# Altium schematic sheet Sheet1.SchDoc
size A4
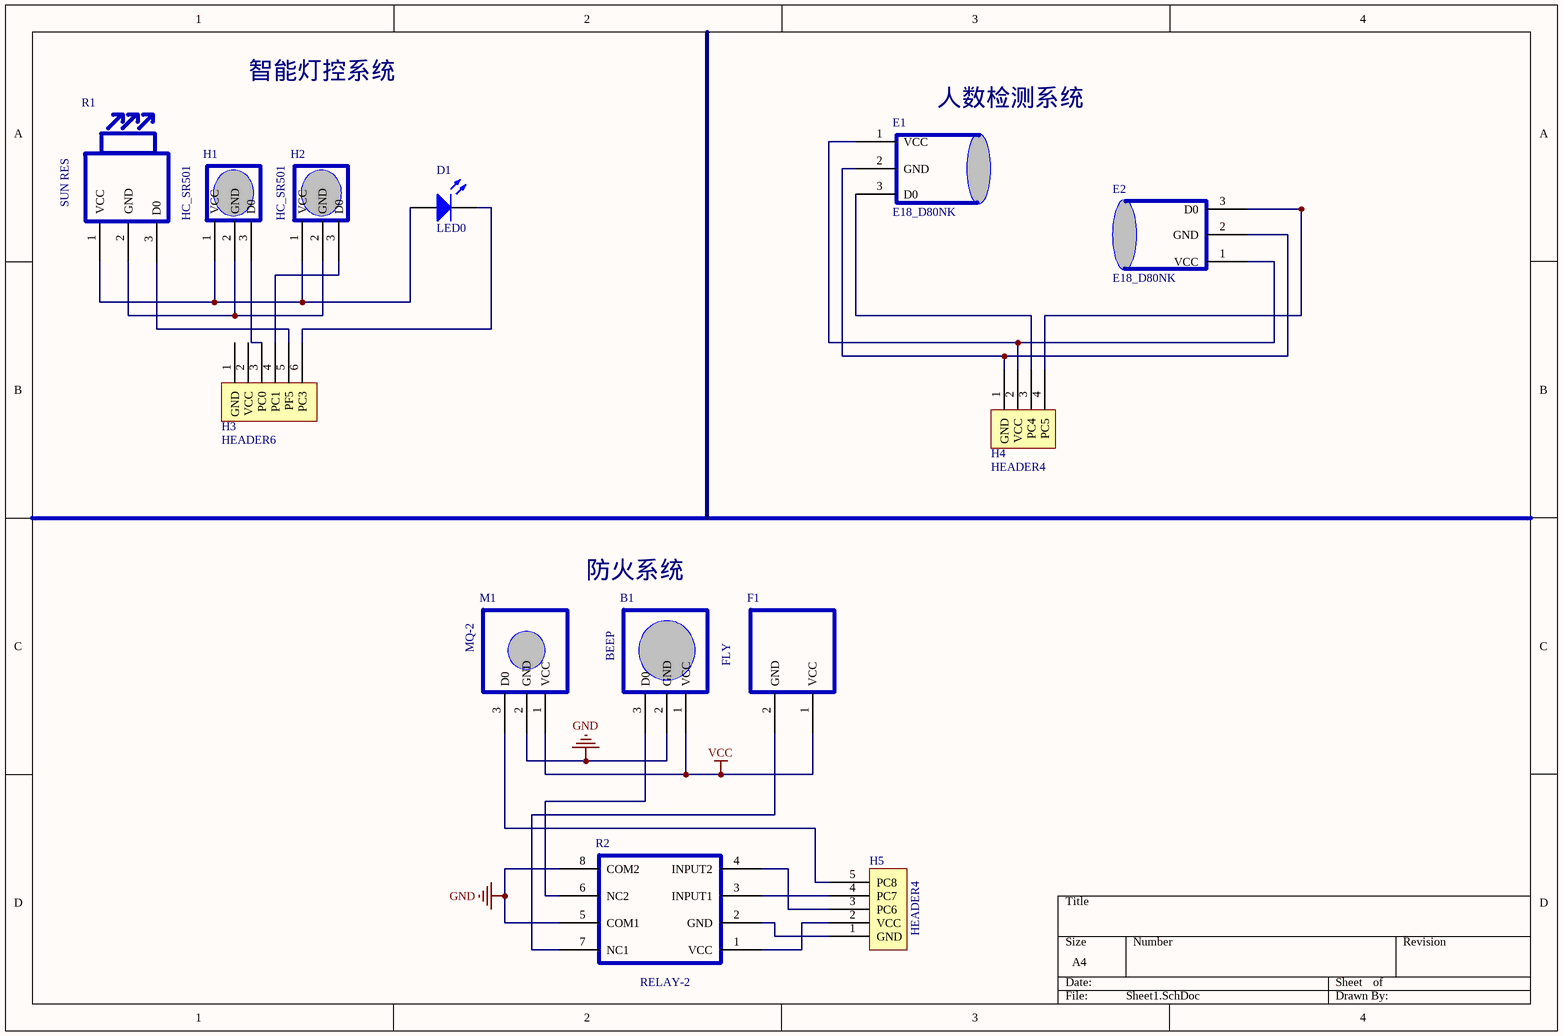
[diagram p0: Sheet1.SchDoc]

## Parts
B1  BEEP
D1  LED0  [LED-0]
E1  E18_D80NK
E2  E18_D80NK
F1  FLY
H1  HC_SR501
H2  HC_SR501
H3  HEADER6
H4  HEADER4
H5  HEADER4
M1  MQ-2
R1  SUN RES
R2  RELAY-2

## Nets
GND: B1.2(GND) M1.2(GND) R2.5(COM1) R2.8(COM2)
VCC: B1.1(VCC) F1.1(VCC) M1.1(VCC)
NetB1_3: B1.3(D0) R2.6(NC2)
NetD1_1: D1.1(A) H1.1(VCC) H2.1(VCC) R1.1(VCC)
NetD1_2: D1.2(K) H3.6(PC3)
NetE1_1: E1.1(VCC) E2.1(VCC) H4.2(VCC)
NetE1_2: E1.2(GND) E2.2(GND) H4.1(GND)
NetE1_3: E1.3(D0) H4.3(PC4)
NetE2_3: E2.3(D0) H4.4(PC5)
NetF1_2: F1.2(GND) R2.7(NC1)
NetH1_2: H1.2(GND) H2.2(GND) R1.2(GND)
NetH1_3: H1.3(D0) H3.3(PC0)
NetH2_3: H2.3(D0) H3.4(PC1)
NetH3_5: H3.5(PF5) R1.3(D0)
NetH5_1: H5.1(GND) R2.2(GND)
NetH5_2: H5.2(VCC) R2.1(VCC)
NetH5_3: H5.3(PC6) R2.4(INPUT2)
NetH5_4: H5.4(PC7) R2.3(INPUT1)
NetH5_5: H5.5(PC8) M1.3(D0)

Not connected (* = marked no-connect by the designer): H3 1(GND) 2(VCC)

## Notes on the sheet
- 智能灯控系统
- (near E1) 人数检测系统
- 防火系统

## Library data of the parts
D1 = LED0: Typical INFRARED GaAs LED; Published: 8-Jun-2000; LatestRevisionDate: 08-Jul-2005; LatestRevisionNote: Mech Layer 1 removed.; PackageReference: LED-0; Publisher: Altium Limited; PackageDescription: LED; 2 Leads
H3 = Header 6
H4 = Header 4
H5 = Header 4R
R1 = RES_SUN